# EAGLE board capewings (EAGLE 6.3), part 1 of 2
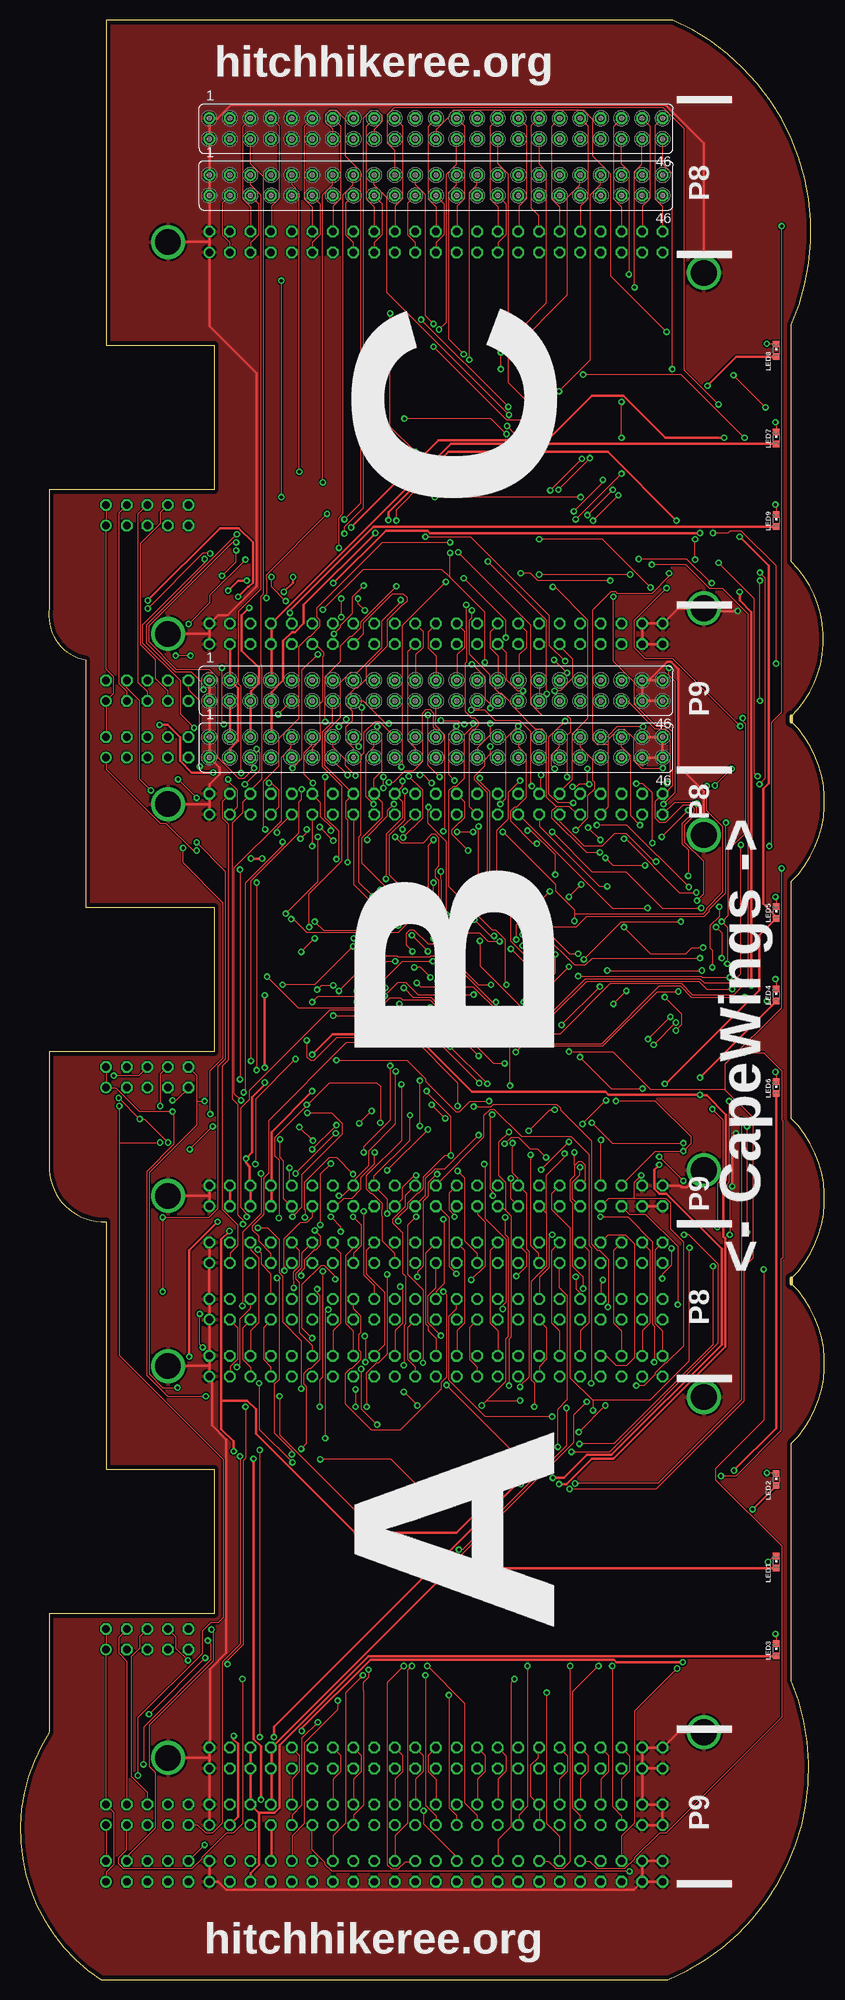
[diagram p3: board, top side]
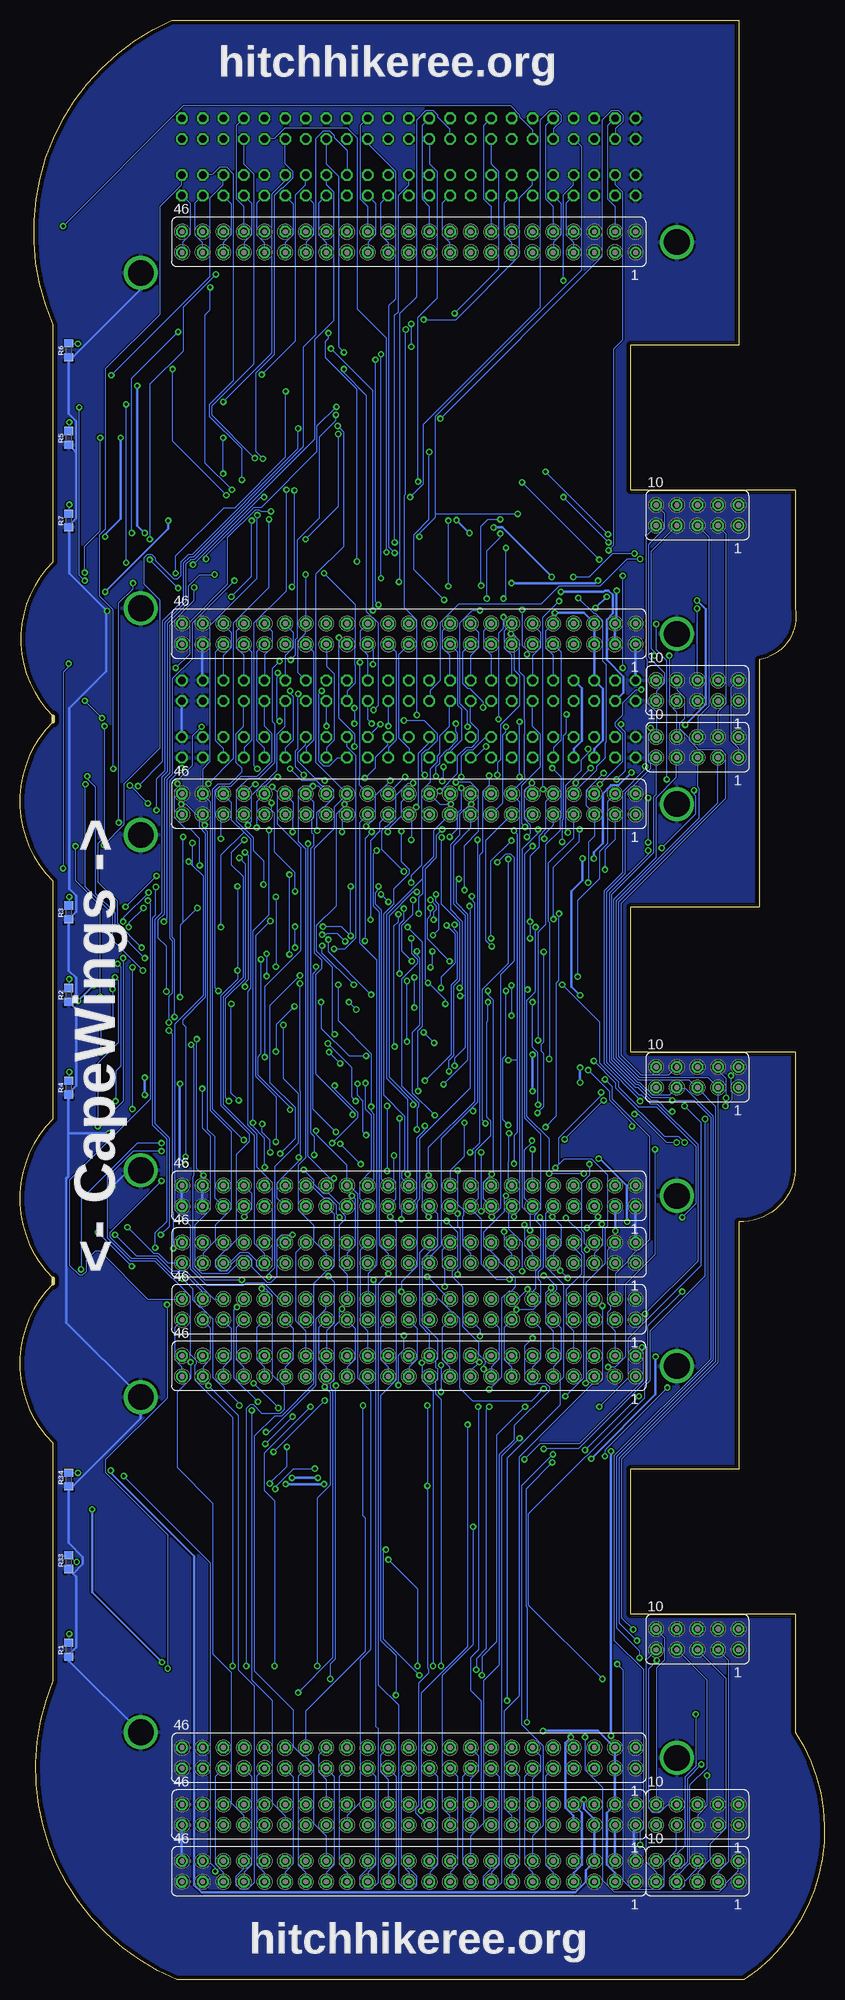
[diagram p4: board, bottom side, seen from below]

Size 99.1 x 241.3 mm. Coordinates in mm from the lower left corner, seen from the top.
Outline: 3.59,183.51 3.59,168.91 arc90 8.04,162.56 8.04,132.08 23.91,132.08 23.91,114.3 3.59,114.3 3.59,99.69 arc90 10.58,93.34 10.58,62.86 23.91,62.86 23.91,45.09 3.59,45.09 3.59,30.48 arc90 9.94,0 79.79,0 arc90 95.03,36.83 95.03,66.04 arc90 95.03,85.72 95.03,86.36 arc90 95.03,106.05 95.03,135.25 arc90 95.03,154.94 95.03,155.57 arc90 95.03,174.62 95.03,203.83 arc90 80.43,241.3 10.58,241.3 10.58,201.3 23.91,201.3 23.91,183.51 3.59,183.51
Copper layers (1*16): Top 0.035mm / dielectric 1.5mm / Bottom 0.035mm
Design rules "default": minimum track width 6mil, minimum drill 15mil, track to track 6mil, track to pad 6mil, pad to pad 6mil, via to via 6mil, smd to smd 6mil, copper to edge 20mil, drill to drill 8mil, minimum pad ring 10mil, minimum via ring 8mil, stop-mask expansion 4mil, vias tented up to drill 20mil, thermal gap 10mil
Net classes: 0 default: width 0.152 mm, drill 0.381 mm, clearance 0.152 mm; 1 pwr: width 0.305 mm, drill 0.381 mm, clearance 0.152 mm

## Footprints (pad centres in the part's own frame; a part is rotated, then mirrored left to right if it is on the bottom)
HOLE = drill 3.175: GND 0,0
CHIPLED_0603 = smd 0.8 x 0.8: A 0,-0.75; C 0,0.75
FE05-2 = drill 0.914: 1 -5.08,1.27 | drill 0.914 octagon: 2 -5.08,-1.27; 3 -2.54,1.27; 4 -2.54,-1.27; 5 0,1.27; 6 0,-1.27; 7 2.54,1.27; 8 2.54,-1.27; 9 5.08,1.27; 10 5.08,-1.27
FE23-2 = drill 0.914: 1 -24.13,1.27 | drill 0.914 octagon: 2 -24.13,-1.27; 3 -21.59,1.27; 4 -21.59,-1.27; 5 -19.05,1.27; 6 -19.05,-1.27; 7 -16.51,1.27; 8 -16.51,-1.27; 9 -13.97,1.27; 10 -13.97,-1.27; 11 -11.43,1.27; 12 -11.43,-1.27; 13 -8.89,1.27; 14 -8.89,-1.27; 15 -6.35,1.27; 16 -6.35,-1.27; 17 -3.81,1.27; 18 -3.81,-1.27; 19 -1.27,1.27; 20 -1.27,-1.27; 21 1.27,1.27; 22 1.27,-1.27; 23 3.81,1.27; 24 3.81,-1.27; 25 6.35,1.27; 26 6.35,-1.27; 27 8.89,1.27; 28 8.89,-1.27; 29 11.43,1.27; 30 11.43,-1.27; 31 13.97,1.27; 32 13.97,-1.27; 33 16.51,1.27; 34 16.51,-1.27; 35 19.05,1.27; 36 19.05,-1.27; 37 21.59,1.27; 38 21.59,-1.27; 39 24.13,1.27; 40 24.13,-1.27; 41 26.67,1.27; 42 26.67,-1.27; 43 29.21,1.27; 44 29.21,-1.27; 45 31.75,1.27; 46 31.75,-1.27
R0603 = smd 1 x 1.1: 1 -0.85,0; 2 0.85,0

## Placement (x,y rotation side)
H1  [HOLE]  18.2,96.52 0 top
H2  [HOLE]  84.24,99.69 0 top
H3  [HOLE]  18.2,144.78 0 top
H4  [HOLE]  84.24,140.97 0 top
H5  [HOLE]  18.2,165.74 0 top
H6  [HOLE]  84.24,168.91 0 top
H7  [HOLE]  84.24,210.19 0 top
H8  [HOLE]  18.2,214 0 top
H9  [HOLE]  18.2,27.3 0 top
H10  [HOLE]  84.24,30.48 0 top
H11  [HOLE]  18.2,75.56 0 top
H12  [HOLE]  84.24,71.75 0 top
LED1  [CHIPLED_0603]  93.13,51.44 0 top
LED2  [CHIPLED_0603]  93.13,61.59 0 top
LED3  [CHIPLED_0603]  93.13,40.64 0 top
LED4  [CHIPLED_0603]  93.13,121.28 0 top
LED5  [CHIPLED_0603]  93.13,131.44 0 top
LED6  [CHIPLED_0603]  93.13,109.86 0 top
LED7  [CHIPLED_0603]  93.13,189.87 0 top
LED8  [CHIPLED_0603]  93.13,200.66 0 top
LED9  [CHIPLED_0603]  93.13,179.7 0 top
P1  [FE05-2]  15.66,180.34 180 bottom
P2  [FE23-2]  47.41,165.74 180 bottom
P3  [FE23-2]  47.41,214 180 bottom
P4  [FE05-2]  15.66,41.91 180 bottom
P5  [FE23-2]  47.41,27.3 180 bottom
P6  [FE05-2]  15.66,111.12 180 bottom
P7  [FE23-2]  47.41,75.56 180 bottom
P8  [FE23-2]  47.41,144.78 180 bottom
P9  [FE23-2]  47.41,96.52 180 bottom
P10  [FE05-2]  15.66,151.76 180 bottom
P11  [FE23-2]  47.41,151.76 0 top
P12  [FE23-2]  47.41,220.98 0 top
P13  [FE05-2]  15.66,158.75 180 bottom
P14  [FE23-2]  47.41,158.75 0 top
P15  [FE23-2]  47.41,227.97 0 top
P16  [FE05-2]  15.66,20.32 180 bottom
P17  [FE23-2]  47.41,20.32 180 bottom
P18  [FE23-2]  47.41,89.53 180 bottom
P19  [FE05-2]  15.66,13.33 180 bottom
P20  [FE23-2]  47.41,13.33 180 bottom
P21  [FE23-2]  47.41,82.55 180 bottom
R1  60  [R0603]  93.13,40.64 90 bottom
R2  4.75K  [R0603]  93.13,121.28 90 bottom
R3  4.75K  [R0603]  93.13,131.44 90 bottom
R4  60  [R0603]  93.13,109.86 90 bottom
R5  4.75K  [R0603]  93.13,189.87 90 bottom
R6  4.75K  [R0603]  93.13,200.66 90 bottom
R7  60  [R0603]  93.13,179.7 90 bottom
R33  4.75K  [R0603]  93.13,51.44 90 bottom
R34  4.75K  [R0603]  93.13,61.59 90 bottom

## Tracks (layer width: path | path; a pad name or v marks a point on that pad's centre or on a via)
1-1.8V  (via drill 0.38)
  Top 0.152: v62.5,38.63 62.5,21.34 61.43,20.27 61.43,19.05 P17.31 | v61.58,73 61.58,73.15 62.65,74.22 62.65,89.69 62.34,89.99 62.34,96.85 61.43,97.77 P9.32 61.35,97.84 61.35,98.68 60.67,99.36 v60.67,103.02 | v61.35,154.38 59.83,152.86 59.83,145.47 v59.14,144.78 | v60.36,110.11 v60.36,116.43
  Bottom 0.152: v62.5,38.63 62.5,59.28 60.9,60.88 60.9,72.31 v61.58,73 | v61.35,154.38 61.35,157.43 P14.32 | v59.14,144.78 59.14,144.55 60.13,143.56 60.13,132.28 62.57,129.84 62.57,126.64 60.59,124.66 60.59,116.66 v60.36,116.43 | v60.36,110.11 60.36,109.65 57.47,106.76 57.47,106.22 v60.67,103.02
1-+3V3  (via drill 0.38)
  Top 0.305: P9.3 25.84,95.25 25.84,97.77 P9.4 | v25.77,92.2 24.78,91.21 24.78,71.32 | 24.78,71.32 24.78,67.82 26.3,66.29 v26.3,65.08 | v26.3,30.02 26.3,29.57 26.83,29.03 26.83,20.04 25.84,19.05 P17.3 | v88.63,177.7 92.21,174.12 92.21,147.37 91.53,146.69 91.53,132.51 93.13,130.91 LED5.A 93.05,130.61 91.07,128.63 91.07,121.84 79.56,110.34 v79.41,110.34 | v86.73,189.89 79.49,189.89 74.31,195.07 70.42,195.07 64.93,189.59 51.52,189.59 v40.78,178.84 | v33.62,172.75 33.62,172.06 v32.47,170.92 | P11.3 25.84,153.09 25.84,157.43 P14.4 | 24.78,71.32 27.98,71.32 29.04,70.26 29.04,67.21 41.24,55.02 53.73,55.02 60.51,61.8 v62.42,61.8 | v65.62,61.8 66.99,61.8 69.81,64.62 72.86,64.62 86.42,78.18 86.42,89.99 79.64,96.77 78.73,96.77 78.12,97.38 78.12,99.75 v78.73,100.36
  Bottom 0.305: P20.4 25.84,14.63 25.84,19.05 P17.3 | v25.77,92.2 25.77,95.25 P9.3 | v26.3,30.02 v26.3,65.08 | v88.63,177.7 88.63,178 86.73,179.91 v86.73,189.89 | v40.78,178.84 39.71,178.84 v33.62,172.75 | v32.47,170.92 27.22,170.92 27.06,171.07 26.61,171.07 26.07,170.54 26.07,168.25 26.83,167.49 26.83,162.53 24.78,160.48 24.78,158.5 25.77,157.5 P14.4 | v65.62,61.8 v62.42,61.8 | v78.73,100.36 79.49,101.12 79.49,110.26 v79.41,110.34
1-+5V  (via drill 0.38)
  Top 0.305: P11.7 30.95,153.09 30.95,157.43 P14.8 30.95,157.58 30.95,158.57 32.4,160.02 32.4,164.9 33.46,165.96 33.84,165.96 34.91,167.03 34.91,169.32 v43.75,178.16 | P20.8 30.95,14.63 30.95,19.05 P17.7 | v83.76,111.1 92.6,119.94 | 92.6,119.94 93.13,120.47 LED4.A | v35.98,113.92 38.49,116.43 48.55,116.43 55.64,109.35 72.1,109.35 72.48,108.97 v83.76,108.97 83.83,108.89 84.59,108.89 86.96,106.53 86.96,98.45 86.65,98.15 86.65,91.52 86.88,91.29 86.88,77.95 73.09,64.16 70.42,64.16 67.3,61.04 v66.38,61.04 | v35.98,109.42 30.95,104.39 30.95,97.84 P9.8 30.95,97.69 30.95,95.25 P9.7 | v31.25,29.87 31.25,31.17 61.12,61.04 v61.66,61.04 | v45.35,179.76 45.35,180.75 52.74,188.14 72.4,188.14 v80.86,179.68 | v88.63,170.92 88.63,169.85 90.08,168.4 v90.08,122.45 | 92.6,119.94 v91.99,120.55
  Bottom 0.305: v83.76,108.97 v83.76,111.1 | v35.98,109.42 v35.98,113.92 | v31.25,29.87 31.94,29.19 31.94,21.18 30.95,20.19 30.95,19.05 P17.7 | v66.38,61.04 v61.66,61.04 | v45.35,179.76 v43.75,178.16 | v80.86,179.68 80.86,178.69 v88.63,170.92 | v91.99,120.55 v90.08,122.45
1-AIN0  (via drill 0.38)
  Top 0.152: v75.91,73.15 76.82,73.15 78.19,74.52 78.19,74.68 79.41,75.89 79.56,75.89 81.7,78.03 81.7,90.91 80.1,92.51 80.1,95.71 79.56,96.24 75.68,96.24 | 75.68,96.24 72.55,96.24 71.56,95.25 P9.39 | v76.75,154.31 73.55,154.31 72.33,153.09 71.56,153.09 P11.39 | v77.36,115.82 v80.1,118.57 | v76.52,99.06 75.68,98.22 75.68,96.24
  Bottom 0.152: v75.91,73.15 72.25,69.49 72.25,38.18 70.27,36.2 70.27,11.96 71.11,11.12 71.94,11.12 72.48,11.66 72.48,12.72 71.56,13.64 71.56,14.55 P20.40 | v76.75,154.31 77.89,153.16 77.89,149.58 79.49,147.98 79.95,147.98 80.4,147.52 80.4,128.4 80.1,128.09 v80.1,118.57 | v77.36,115.82 77.36,99.9 v76.52,99.06
1-AIN1  (via drill 0.38)
  Top 0.152: v78.12,76.05 78.12,80.47 77.89,80.7 77.89,90.91 74.84,93.95 v71.49,93.95 | v71.56,103.4 71.56,97.84 P9.40
  Bottom 0.152: v78.12,76.05 78.12,73.99 79.79,72.31 79.79,63.09 75.37,58.67 75.37,40.16 73.09,37.87 73.09,21.79 71.56,20.27 71.56,19.05 P17.39 | v71.49,93.95 70.57,94.87 70.57,96.85 71.49,97.77 P9.40 | v71.56,103.4 75.37,107.21 75.37,146.61 74.69,147.3 73.24,147.3 71.79,148.74 71.79,149.2 72.48,149.88 72.48,153.47 71.56,154.38 71.56,157.43 P14.40
1-AIN2  (via drill 0.38)
  Top 0.152: v91.6,87.48 91.6,68.88 85.66,62.94 85.66,61.57 93.81,53.42 93.81,32.31 79.56,18.06 78.73,18.06 75.68,15.01 75.68,14.86 74.46,13.64 71.11,13.64 70.19,14.55 69.05,14.55 P20.38 | v81.7,103.02 72.94,103.02 v70.42,105.54 | v68.97,100.05 68.97,99.14 68.06,98.22 68.06,96.16 68.97,95.25 P9.37 | v68.44,141.58 69.96,143.1 69.96,145.85 70.8,146.69 70.8,147.45 70.57,147.68 70.57,150.27 69.05,151.79 69.05,153.01 P11.37
  Bottom 0.152: v91.6,87.48 91.6,96.09 84.67,103.02 v81.7,103.02 | v68.97,100.05 68.97,103.63 70.42,105.08 v70.42,105.54 70.42,129.16 68.44,131.14 v68.44,141.58
1-AIN3  (via drill 0.38)
  Top 0.152: v71.26,38.63 68.06,35.43 68.06,21.18 68.97,20.27 68.97,19.05 P17.37 | v69.35,85.11 69.35,86.56 68.06,87.86 68.06,95.71 67.75,96.01 67.75,98.45 68.29,98.98 68.29,100.28 68.33,100.32 | 68.33,100.32 68.74,100.74 69.2,100.74 69.66,100.28 69.66,98.45 P9.38 | v73.09,120.17 v74.69,121.77 | v69.28,105.38 v72.17,108.28 | v68.29,101.88 68.29,100.36 68.33,100.32
  Bottom 0.152: v71.26,38.63 71.26,70.33 70.8,70.79 70.34,70.79 69.28,69.72 67.07,69.72 66.61,70.18 66.61,73.08 68.06,74.52 68.06,84.28 68.9,85.11 v69.35,85.11 | v74.69,121.77 75.07,122.15 75.07,146.46 74.54,146.99 73.09,146.99 71.87,148.21 69.89,148.21 68.06,150.04 68.06,153.47 68.97,154.38 68.97,157.43 P14.38 | v73.09,120.17 73.09,109.19 v72.17,108.28 | v69.28,105.38 69.28,104.39 68.29,103.4 v68.29,101.88
1-AIN4  (via drill 0.38)
  Top 0.152: v67.75,38.63 67.75,14.55 66.84,13.64 66.08,13.64 65.16,14.55 63.94,14.55 P20.34 | v63.33,70.56 63.33,73.53 62.95,73.91 62.95,85.95 64.86,87.86 64.86,94.34 64.82,94.37 | 64.82,94.37 63.94,95.25 P9.33 | v61.58,147.68 60.13,146.23 60.13,142.95 58.76,141.58 58.76,135.64 60.44,133.96 60.44,127.86 v64.63,123.67 | v67.07,101.73 67.07,101.27 64.86,99.06 64.86,94.41 64.82,94.37
  Bottom 0.152: v67.75,38.63 67.75,58.98 69.05,60.27 69.05,64.85 v63.33,70.56 | v61.58,147.68 61.89,147.98 62.8,147.98 64.86,150.04 64.86,151.18 63.94,152.09 63.94,153.01 P11.33 | v64.63,123.67 68.29,120.02 68.29,110.49 65.16,107.37 65.16,103.63 v67.07,101.73
1-AIN5  (via drill 0.38)
  Top 0.152: v70.57,70.1 70.57,71.32 70.54,71.36 | 70.54,71.36 67.75,74.14 67.75,92.58 65.47,94.87 65.47,96.77 66.46,97.77 P9.36 | v71.03,142.19 74.76,142.19 v82.38,134.57 | v82.46,90.14 82.46,76.2 77.66,71.4 70.57,71.4 70.54,71.36
  Bottom 0.152: P17.35 66.46,20.19 68.06,21.79 68.06,34.44 70.57,36.96 v70.57,70.1 | P14.36 66.46,154.38 67.45,153.39 67.45,148.97 70.57,145.85 70.57,142.65 v71.03,142.19 | v82.38,134.57 82.38,131.14 82.77,130.76 82.77,105.23 81.01,103.48 81.01,93.42 82.46,91.97 v82.46,90.14
1-AIN6  (via drill 0.38)
  Top 0.152: P20.36 66.46,17.68 64.86,19.28 v64.86,35.36 | v59.45,82.6 59.45,83.06 59.83,83.44 59.83,91.21 57.24,93.8 57.24,100.36 v57.16,100.43 | v59.68,102.95 60.44,103.71 61.43,103.71 62.88,102.26 63.79,102.26 v64.78,101.27 | P11.35 66.46,151.87 65.47,150.88 65.47,149.5 v65.85,149.12 | v62.5,141.5 62.95,141.5 65.93,138.53 v65.93,136.09 | v65.93,126.26 65.93,123.98 v64.63,122.68
  Bottom 0.152: v64.86,35.36 60.59,39.62 60.59,72.62 60.9,72.92 60.9,73.38 60.44,73.84 60.44,80.39 59.83,81 59.83,82.22 v59.45,82.6 | v59.68,102.95 v57.16,100.43 | P9.35 67.45,96.24 67.45,98.15 64.78,100.81 v64.78,101.27 64.55,101.5 64.55,109.35 64.63,109.42 v64.63,122.68 | v65.85,149.12 64.4,147.68 62.57,147.68 61.89,146.99 60.97,146.99 60.44,146.46 60.44,145.62 61.58,144.47 61.81,144.47 62.5,143.79 v62.5,141.5 | v65.93,126.26 v65.93,136.09
1-BAT  (via drill 0.38)
  Top 0.152: P19.2 10.6,14.63 10.6,19.05 P16.1 | P6.2 10.6,112.39 10.6,109.88 P6.1 10.6,109.8 11.82,109.8 14.72,106.91 v18.76,106.91 18.91,106.76 18.91,102.87 15.56,99.52 15.56,74.45 18.15,71.86 v22.87,71.86 | v21.73,139.06 21.27,139.06 17.92,142.42 17.23,142.42 10.6,149.05 10.6,150.5 P10.1 | v29.5,65.23 v29.5,29.87
  Bottom 0.152: P10.1 10.6,150.5 10.6,151.71 11.52,152.63 11.52,159.11 10.6,160.02 P13.2 | v18.76,106.91 19.21,106.91 20.59,108.28 21.42,108.28 23.02,109.88 23.33,109.88 26.53,113.08 26.53,133.81 21.73,138.61 v21.73,139.06 | v29.5,29.87 29.5,25.83 27.37,23.7 27.37,12.27 25.92,10.82 12.97,10.82 12.13,11.66 12.13,11.89 10.6,13.41 10.6,14.55 P19.2 | v22.87,71.86 v29.5,65.23
1-BAT_SENSE  (via drill 0.38)
  Top 0.152: P19.4 13.12,15.16 16.62,18.67 16.62,25.53 15.86,26.29 15.86,31.32 23.79,39.24 23.79,42.9 v23.56,43.13
  Bottom 0.152: v23.56,43.13 25.01,44.58 25.01,64.08 13.12,75.97 P6.3 13.12,109.88 14.34,111.1 22.72,111.1 25.31,113.69 25.31,132.74 13.12,144.93 P10.3
1-BAT_TEMP  (via drill 0.38)
  Top 0.152: P16.3 13.12,16 12.13,15.01 12.13,14.25 12.74,13.64 21.12,13.64 22.34,14.86 22.34,15.01 25.39,18.06 26.22,18.06 27.37,19.2 v27.37,37.03 | v12.13,108.58 v14.72,105.99 15.33,105.99 v18.22,103.1 | P13.4 13.12,159.11 14.72,157.5 14.72,147.83 v16.09,146.46 | v20.05,139.37 20.05,137.54 25.01,132.59 25.01,113.54 23.41,111.94 v23.41,106.6
  Bottom 0.152: v27.37,37.03 36.51,46.18 36.51,57.3 22.19,71.63 22.19,73.08 21.5,73.76 21.5,79.86 14.72,86.64 v14.72,105.99 | v12.13,108.58 12.13,111.02 13.12,112.01 P6.4 | v16.09,146.46 16.09,146 15.86,145.77 15.86,143.56 v20.05,139.37 | v23.41,106.6 22.95,106.6 19.44,103.1 v18.22,103.1
1-BL_IN  (via drill 0.38)
  Top 0.152: v25.54,38.86 25.54,39.32 27.44,41.22 27.44,63.93 27.75,64.24 v27.75,70.56 | v17.23,107.59 17.23,111.48 18.15,112.39 P6.8
  Bottom 0.152: v25.54,38.86 24.85,38.18 24.85,12.27 23.71,11.12 20.28,11.12 19.75,11.66 19.75,14.4 18.22,15.93 18.22,19.05 P16.7 | v27.75,70.56 24.24,74.07 24.24,78.94 15.25,87.94 15.25,105.61 v17.23,107.59 | P13.8 18.15,160.02 18.15,158.8 17.23,157.89 17.23,155.37 17.84,154.76 17.84,154.08 16.62,152.86 16.62,152.63 15.48,151.49 12.74,151.49 12.13,150.88 12.13,145.47 25.01,132.59 25.01,113.84 22.57,111.4 19.21,111.4 18.22,112.39 P6.8
1-BL_ISET1  (via drill 0.38)
  Top 0.152: v14.49,25.15 14.49,32.23 22.41,40.16 22.41,42.9 23.48,43.97 24.4,43.97 25.01,44.58 25.01,64.08 12.2,76.89 12.2,103.1 | v12.2,107.59 12.2,103.1 | v11.52,111.33 14.57,111.33 15.63,112.39 P6.6 | v15.71,168.86 22.49,175.64 v23.41,175.64 | v30.95,172.75 30.95,171.53 v32.7,169.77 | v34.68,146.61 34.68,145.39 34.38,145.09 34.38,141.28 28.43,135.33 v28.43,113.16 | 12.2,103.1 v17.23,103.1
  Bottom 0.152: v14.49,25.15 14.49,21.41 15.63,20.27 15.63,19.05 P16.5 | v12.2,107.59 11.44,108.36 11.44,109.35 11.52,109.42 v11.52,111.33 | v15.71,168.86 15.71,160.02 P13.6 | v23.41,175.64 26.07,175.64 28.97,172.75 v30.95,172.75 | v32.7,169.77 34.68,167.79 v34.68,146.61 | v28.43,113.16 25.69,110.41 25.69,109.8 19.67,103.78 17.92,103.78 v17.23,103.1
1-BL_ISET2  (via drill 0.38)
  Top 0.152: v15.18,26.52 15.18,31.09 23.48,39.39 23.48,41.38 v23.1,41.76
  Bottom 0.152: v15.18,26.52 16.93,24.77 16.93,14.48 17.77,13.64 18,13.64 19.14,12.5 19.14,11.66 18.6,11.12 17.77,11.12 17.23,11.66 17.23,12.12 15.71,13.64 15.71,14.55 P19.6 | v23.1,41.76 25.31,43.97 25.31,64.24 13.42,76.12 13.42,107.59 15.63,109.8 P6.5 15.71,109.88 16.62,110.8 22.87,110.8 25.62,113.54 25.62,132.89 15.4,143.1 15.4,146.69 15.63,146.91 15.63,150.5 P10.5
1-BL_OUT  (via drill 0.38)
  Top 0.152: v22.8,39.62 v15.86,32.69
  Bottom 0.152: v15.86,32.69 15.86,26.29 17.23,24.92 17.23,16.46 18.15,15.55 18.15,14.63 P19.8 | v22.8,39.62 22.8,40.54 25.62,43.36 25.62,64.39 13.73,76.28 13.73,106.38 17.16,109.8 18.15,109.8 P6.7 18.22,109.8 19.14,108.89 21.12,108.89 22.72,110.49 23.02,110.49 25.92,113.39 25.92,133.05 20.74,138.23 20.74,145.54 18.22,148.06 18.22,150.5 P10.7
1-BL_SINK1  (via drill 0.38)
  Top 0.152: v22.72,16.61 20.74,14.63 P19.10 | v18.76,108.28 19.21,108.28 20.74,109.8 P6.9
  Bottom 0.152: v22.72,16.61 22.72,18.21 22.34,18.59 22.34,38.25 25.92,41.83 25.92,64.54 14.03,76.43 14.03,106.22 16.09,108.28 v18.76,108.28 19.06,108.58 21.27,108.58 22.87,110.19 23.18,110.19 26.22,113.23 26.22,133.66 21.04,138.84 21.04,145.69 20.74,146 P10.9
1-BL_SINK2  (via drill 0.38)
  Top 0.152: P16.9 21.88,19.05 22.87,18.06 23.63,18.06 24.85,19.28 24.85,39.09 27.06,41.3 v27.06,64.47 | v19.37,72.92 17.54,72.92 15.86,74.6 15.86,99.36 21.73,105.23 21.73,108.2 | 21.73,108.2 21.73,111.4 P6.10 | P13.10 20.74,158.88 22.11,157.5 v22.11,149.43 | 21.73,108.2 v22.72,108.2
  Bottom 0.152: v27.06,64.47 27.06,65.23 v19.37,72.92 | v22.11,149.43 22.11,149.05 24.85,146.3 24.85,136.4 27.14,134.11 27.14,112.78 22.72,108.36 v22.72,108.2
1-CLKOUT2  (via drill 0.38)
  Top 0.152: P20.42 74.08,17.68 75.68,19.28 75.68,33.07 v80.94,38.33 | v81.01,83.13 81.01,90.3 77.05,94.26 75.07,94.26 P9.41 | P11.41 74.08,151.87 75.22,150.72 75.22,143.33 v76.36,142.19
  Bottom 0.152: v80.94,38.33 80.94,54.79 88.63,62.48 88.63,64.01 81.01,71.63 v81.01,83.13 | v76.36,142.19 76.36,141.73 75.98,141.35 75.98,104.7 75.07,103.78 75.07,96.24 P9.41
1-EHRPWM1A  (via drill 0.38)
  Top 0.152: v27.37,82.98 27.37,92.05 29.65,94.34 v29.65,99.29 | v38.87,104.24 v33.92,99.29 | v35.6,129.62 35.6,133.73 39.64,137.77 39.64,146.99 37.27,149.35 37.27,153.69 38.49,154.91 38.49,157.43 P14.14
  Bottom 0.152: v27.37,82.98 27.37,73.91 27.98,73.3 28.66,73.3 37.65,64.31 37.65,34.9 39.48,33.07 39.48,21.18 38.57,20.27 38.57,19.05 P17.13 | v29.65,99.29 v33.92,99.29 33.92,103.56 36.66,106.3 36.66,120.62 35.6,121.69 v35.6,129.62 | v38.87,104.24 38.87,100.81 38.95,100.74 38.95,98.22 P9.14
1-EHRPWM1B  (via drill 0.38)
  Top 0.152: v42.91,38.18 42.91,37.26 42.23,36.58 42.23,35.66 42.3,35.59 42.3,21.49 41.08,20.27 41.08,19.05 P17.15 | v41.31,72.69 v41.31,70.56 | v39.26,96.55 39.71,96.55 41.01,97.84 P9.16 41.08,97.84 41.08,98.37 42.99,100.28 42.99,102.11 46.27,105.38 v46.27,111.86 | v45.43,154.69 45.05,154.69 42.3,157.43 41.08,157.43 P14.16 | v47.87,148.21 49.62,146.46 49.62,143.1 v47.18,140.66
  Bottom 0.152: v42.91,38.18 42.91,39.55 41.69,40.77 41.69,70.18 v41.31,70.56 | v41.31,72.69 39.79,74.22 39.79,83.9 38.87,84.81 38.57,84.81 38.11,85.27 38.11,86.49 40.09,88.47 40.09,88.7 41.24,89.84 41.46,89.84 42,90.37 42,92.05 39.48,94.56 39.48,96.32 v39.26,96.55 | v45.43,154.69 45.43,153.69 45.2,153.47 45.2,152.63 46.34,151.49 46.49,151.49 47.41,150.57 47.41,149.81 47.87,149.35 v47.87,148.21 | v47.18,140.66 47.18,132.44 44.89,130.15 44.89,123.14 45.66,122.38 45.66,113.84 46.27,113.23 v46.27,111.86
1-EHRPWM2A  (via drill 0.38)
  Top 0.152: v48.93,86.56 48.93,87.17 49.62,87.86 49.62,95.86 50.23,96.47 50.23,98.15 51.29,99.21 v51.37,99.21 | v86.04,194 81.85,198.2 81.85,227.91 79.26,230.5 46.04,230.5 45.2,229.67 45.2,226.24 46.11,225.32 46.11,222.28 P12.19 | v86.04,174.5 90.46,170.08 90.46,148.59 v90.84,148.21 | v83.76,125.81 70.5,125.81 69.66,124.97 68.29,124.97 64.55,128.7 v61.89,128.7 | v59.07,127.86 57.62,127.86 56.55,128.93 51.14,128.93 50,130.07 v50,131.29
  Bottom 0.152: v48.93,86.56 46.19,83.82 P21.20 | v51.37,99.21 51.37,108.43 53.96,111.02 53.96,131.14 49.58,135.52 | 49.58,135.52 49.54,135.56 49.54,136.93 48.17,138.3 48.17,141.5 46.19,143.49 P8.19 | v86.04,174.5 v86.04,194 | v90.84,148.21 90.84,147.9 89.78,146.84 89.78,133.73 87.41,131.37 87.41,129.46 v83.76,125.81 | v61.89,128.7 61.43,128.7 61.35,128.78 59.98,128.78 v59.07,127.86 | v50,131.29 50,133.27 49.54,133.73 49.54,135.48 49.58,135.52
1-EHRPWM2B  (via drill 0.38)
  Top 0.152: v36.59,85.04 36.59,84.58 36.97,84.2 36.97,76.43 35.83,75.29 35.6,75.29 34.99,74.68 34.99,73.3 35.29,73 35.29,66.06 v34.61,65.38 | v17.54,84.73 v17.54,93.88 23.25,93.88 24.4,95.02 24.4,112.47 25.31,113.39 25.31,136.47 v21.73,140.06 | v32.32,122.53 36.28,122.53 v41.01,127.25 | v37.27,184.4 37.27,219.84 38.49,221.06 38.49,222.2 P12.13 | v27.75,174.88 23.41,170.54 23.41,169.62 v20.74,166.95 | v21.73,145.54 v19.44,147.83
  Bottom 0.152: P21.14 37.81,83.82 v36.59,85.04 | v34.61,65.38 30.34,65.38 21.81,73.91 21.81,80.47 v17.54,84.73 | v17.54,93.88 15.86,95.55 15.86,102.64 20.74,107.52 22.95,107.52 25.39,109.96 25.39,110.57 27.75,112.93 27.75,117.96 v32.32,122.53 | v41.01,127.25 41.77,128.02 41.77,140.28 38.57,143.49 P8.13 | v27.75,174.88 v37.27,184.4 | v20.74,166.95 20.74,163.75 19.44,162.46 v19.44,147.83 | v21.73,140.06 v21.73,145.54
1-GPIO0_7  (via drill 0.38)
  Top 0.152: P17.41 74.08,20.19 72.94,21.34 v72.94,38.63 | P9.42 74.08,97.84 78.27,102.03 v81.7,102.03 82.69,103.02 82.69,103.78 78.27,108.2 v73.39,108.2 | v79.72,147.3 80.1,147.68 80.1,153.47 79.56,154 78.27,154 74.84,157.43 74.08,157.43 P14.42 | v76.97,137.24 73.01,137.24 v72.1,138.15
  Bottom 0.152: v72.94,38.63 72.94,69.27 77.58,73.91 77.58,75.67 77.43,75.82 77.43,76.28 78.19,77.04 78.19,84.2 82.54,88.54 85.58,88.54 88.4,91.36 88.4,98.83 85.2,102.03 v81.7,102.03 | v79.72,147.3 79.72,146.84 80.1,146.46 80.1,143.1 78.65,141.66 78.12,141.66 76.97,140.51 v76.97,137.24 | v72.1,138.15 71.34,137.39 71.34,123.29 73.77,120.85 73.77,108.58 v73.39,108.2
1-GPIO0_26  (via drill 0.38)
  Top 0.152: v39.48,92.13 39.48,92.73 v38.26,93.95 | v39.94,179.83 42,181.89 42,222.66 40.09,224.56 40.09,229.06 38.95,230.2 38.11,230.2 37.58,229.67 37.58,228.83 38.49,227.91 38.49,226.69 P15.14 | v42.3,171.68 40.93,170.31 40.93,168.25 39.48,166.8 39.48,166.57 v38.65,165.74
  Bottom 0.152: v39.48,92.13 39.48,90.37 38.57,89.46 38.57,88.32 P18.13 | v38.26,93.95 38.26,94.11 37.58,94.79 37.58,145.09 38.49,146 P8.14 38.49,146.07 38.49,146.3 36.89,147.9 36.89,148.36 36.97,148.44 36.97,153.39 36.89,153.47 36.89,155.14 36.97,155.22 36.97,160.48 37.58,161.09 37.58,164.9 38.42,165.74 v38.65,165.74 | v39.94,179.83 41.46,179.83 42.3,178.99 v42.3,171.68
1-GPIO0_27  (via drill 0.38)
  Top 0.152: P21.18 43.6,85.5 42.3,86.79 v42.3,94.64 | v42.3,101.88 42.3,102.56 45.58,105.84 v45.58,112.55 | P12.17 43.6,221.06 45.2,219.46 45.2,207.72 v60.21,192.71 | v67.37,160.93 v65.77,162.53 | v67.14,154.99 66.15,154 66.08,154 65.16,153.09 65.16,146 66.23,144.93 v68.13,144.93 | v65.24,134.04 61.12,129.92 v61.12,128.09 | v55.87,121.31 49.01,121.31 47.48,122.83 46.57,122.83 v44.89,121.16
  Bottom 0.152: v42.3,101.88 v42.3,94.64 | v45.58,112.55 45.58,113.46 44.28,114.76 44.28,121.16 | 44.28,121.16 44.28,131.06 45.73,132.51 45.73,139.68 43.6,141.81 P8.17 | v60.21,192.71 60.21,192.02 62.19,190.04 62.19,180.06 64.93,177.32 64.93,165.28 65.16,165.05 65.16,163.14 v65.77,162.53 | v67.37,160.93 67.37,160.48 67.45,160.4 67.45,155.3 v67.14,154.99 | v68.13,144.93 68.13,144.02 67.75,143.64 67.75,138.84 65.24,136.32 v65.24,134.04 | v61.12,128.09 61.12,126.57 v55.87,121.31 | 44.28,121.16 v44.89,121.16
1-GPIO1_0  (via drill 0.38)
  Top 0.152: v65.54,69.34 57.31,69.34 52.82,73.84 52.82,81.69 53.73,82.6 53.73,83.82 P21.26 | v68.9,65.99 73.16,65.99 85.36,78.18 v85.36,87.86 | v89.55,105.08 v89.55,92.05 | v87.41,123.44 84.06,123.44 83.91,123.6 v68.74,123.6 | v68.74,126.34 67.68,126.34 64.32,129.69 v61.81,129.69 | v58.38,128.55 57.92,128.55 v55.94,130.53 | v54.65,200.18 52.82,202.01 52.82,220.14 53.73,221.06 53.73,222.2 P12.25 | v54.65,172.59 59.83,167.41 v59.83,165.28 | v57.92,151.87 57.92,150.95 57.24,150.27 57.24,149.5 55.94,148.21 55.94,147.75 57.54,146.15 57.54,135.48 v58.38,134.64
  Bottom 0.152: v68.9,65.99 v65.54,69.34 | v89.55,92.05 v85.36,87.86 | v89.55,105.08 89.55,112.85 87.03,115.37 87.03,123.06 v87.41,123.44 | v68.74,126.34 v68.74,123.6 | v61.81,129.69 59.52,129.69 v58.38,128.55 v58.38,134.64 | v55.94,130.53 55.94,140.28 54.8,141.43 54.8,142.49 53.81,143.49 P8.25 | v54.65,172.59 v54.65,200.18 | v59.83,165.28 59.83,155.37 57.85,153.39 57.85,151.94 v57.92,151.87
1-GPIO1_1  (via drill 0.38)
  Top 0.152: P18.23 51.22,85.19 50.23,84.2 50.23,80.92 v51.83,79.32 | v62.8,62.94 v52.51,73.23 | v67.68,60.43 78.35,60.43 89.17,71.25 89.17,87.78 90.23,88.85 90.23,106.22 86.84,109.61 | 86.84,109.61 86.8,109.65 77.66,109.65 73.01,114.3 v67.6,114.3 | v65.32,119.86 62.42,119.86 62.27,119.71 61.81,119.71 56.63,124.89 v56.63,127.94 | v53.81,141.35 v55.79,141.35 | P15.24 51.22,227.84 52.82,229.44 52.82,229.67 53.35,230.2 69.43,230.2 70.57,229.06 70.57,224.56 72.78,222.35 72.78,209.78 v79.64,202.92 | v85.36,178.16 87.18,178.16 87.41,178.38 88.86,178.38 93.13,174.12 v93.13,162.08 | v93.81,136.85 93.81,119.71 86.88,112.78 86.88,109.65 86.84,109.61
  Bottom 0.152: v51.83,79.32 51.83,77.57 52.51,76.89 v52.51,73.23 | v62.8,62.94 65.39,62.94 67.68,60.66 v67.68,60.43 | v67.6,114.3 67.6,117.58 v65.32,119.86 | v56.63,127.94 56.63,140.51 v55.79,141.35 | v53.81,141.35 53.81,141.66 52.21,143.26 52.21,145.01 51.22,146 P8.24 | v79.64,202.92 85.36,197.21 v85.36,178.16 | v93.13,162.08 93.13,161.7 93.74,161.09 93.74,136.93 v93.81,136.85
1-GPIO1_2  (via drill 0.38)
  Top 0.152: P21.6 28.36,82.68 27.06,81.38 27.06,75.82 v26.68,75.44 | v23.71,105.08 v20.89,102.26 | v29.12,135.1 v29.12,112.01 | P12.5 28.36,221.06 29.65,219.76 29.65,171.3 26.91,168.55 26.91,159.56 27.22,159.26 v27.22,148.59
  Bottom 0.152: v26.68,75.44 25.84,75.44 24.55,76.73 24.55,85.65 20.89,89.31 v20.89,102.26 | v23.71,105.08 23.71,105.54 26.53,108.36 26.53,109.42 v29.12,112.01 | v29.12,135.1 29.12,140.06 28.36,140.82 P8.5 28.36,143.56 29.35,144.55 29.35,146.46 v27.22,148.59
1-GPIO1_3  (via drill 0.38)
  Top 0.152: v27.44,93.04 27.44,93.5 26.76,94.18 26.76,107.82 26.07,108.51 26.07,142.42 27.37,143.71 27.37,145.01 28.36,146 P8.6 28.36,146.46 29.81,147.9 29.81,161.77 29.65,161.93 29.65,170.38 29.96,170.69 29.96,222.05 28.36,223.65 P15.6
  Bottom 0.152: P18.5 28.36,89.46 27.37,90.45 27.37,92.96 v27.44,93.04
1-GPIO1_4  (via drill 0.38)
  Top 0.152: P21.24 51.22,84.73 52.21,85.72 52.21,93.57 v52.13,93.65 | v50.69,107.75 v52.36,106.07 | 50.23,134.64 50.23,139.68 v50.91,140.36 | 50.23,134.64 v50.23,133.96 | v52.97,177.01 44.67,177.01 36.59,168.94 36.59,167.79 36.97,167.41 36.97,166.65 35.75,165.43 35.6,165.43 34.38,164.21 34.38,155.37 31.86,152.86 31.86,149.5 29.96,147.6 29.96,141.88 v30.19,141.66 | v33.39,130.61 33.69,130.61 35.37,128.93 46.57,128.93 v48.17,130.53 | 50.23,134.64 v48.55,132.97
  Bottom 0.152: v52.13,93.65 52.13,94.79 52.36,95.02 v52.36,106.07 | v50.69,107.75 50.69,108.2 53.66,111.18 53.66,130.99 50.69,133.96 v50.23,133.96 | v50.91,140.36 50.91,143.18 51.22,143.49 P8.23 | P12.23 51.22,221.06 52.51,219.76 52.51,205.44 52.97,204.98 v52.97,177.01 | v30.19,141.66 30.19,140.21 33.39,137.01 v33.39,130.61 | v48.17,130.53 48.17,131.44 47.87,131.75 47.87,132.28 v48.55,132.97
1-GPIO1_5  (via drill 0.38)
  Top 0.152: v42.76,140.36 42.76,140.82 45.2,143.26 45.2,143.94 v46.04,144.78 | v50.08,184.48 49.77,184.48 46.34,181.05 v46.34,179.68 | v46.34,171.6 42,167.26 42,166.57 40.86,165.43 40.63,165.43 39.48,164.29 39.48,162.38 37.58,160.48 v37.58,154.91 | v37.58,148.13 37.58,143.1 39.26,141.43 39.26,138.3 v38.95,138 | v43.29,106.98 v41.77,105.46
  Bottom 0.152: 43.56,107.25 42.76,108.05 v42.76,140.36 | 43.56,107.25 47.26,103.56 47.26,90.37 48.63,89 48.63,88.32 P18.21 | v46.04,144.78 47.41,144.78 P8.22 | v50.08,184.48 50.08,204.75 47.71,207.11 47.71,222.66 48.63,223.57 48.63,226.69 P15.22 | v46.34,171.6 v46.34,179.68 | v37.58,148.13 v37.58,154.91 | v38.95,138 38.95,125.2 42.15,122 42.15,105.84 v41.77,105.46 | 43.56,107.25 v43.29,106.98
1-GPIO1_6  (via drill 0.38)
  Top 0.152: v27.06,136.7 v27.06,110.87 | v26.61,176.02 26.61,174.65 v24.85,172.9 | v24.85,161.54 24.85,154.84 v25.08,154.61 | v25.62,147.83 25.62,147.6 26.76,146.46 26.76,144.47 25.84,143.56 P8.3
  Bottom 0.152: v27.06,110.87 26.22,110.03 26.22,108.51 21.58,103.86 21.58,91.14 22.87,89.84 23.1,89.84 24.24,88.7 24.24,88.47 25.77,86.94 25.77,83.82 P21.4 | v27.06,136.7 27.06,139.14 25.84,140.36 25.84,143.49 P8.3 | v26.61,176.02 25.92,176.71 25.92,200.86 24.85,201.93 24.85,220.14 25.77,221.06 25.77,222.2 P12.3 | v24.85,161.54 v24.85,172.9 | v25.08,154.61 25.08,154.15 24.55,153.62 24.55,148.89 v25.62,147.83
1-GPIO1_7  (via drill 0.38)
  Top 0.152: P8.4 24.85,145.09 24.85,143.1 25.62,142.34 25.62,113.23 24.85,112.47 24.85,94.87 26.76,92.96 26.76,90.37 25.84,89.46 25.84,88.32 P18.3 | v47.33,192.25 58,192.25 v59.91,190.35 | v63.94,177.39 71.72,177.39 v77.66,171.45 | v81.09,121.69 78.5,121.69 71.79,114.99 61.81,114.99 v61.05,114.22 | v59.68,112.85 58.31,112.85 50.46,120.7 47.1,120.7 46.88,120.93 45.58,120.93 44.36,119.71 34.23,119.71 v30.42,123.52
  Bottom 0.152: v47.33,192.25 27.37,212.22 27.37,229.06 26.22,230.2 25.39,230.2 24.85,229.67 24.85,228.83 25.77,227.91 25.77,226.69 P15.4 | v59.91,190.35 59.91,181.43 v63.94,177.39 | v77.66,171.45 77.66,169.85 80.63,166.88 80.63,148.67 81.32,147.98 81.32,131.29 82.08,130.53 82.08,128.25 81.09,127.25 v81.09,121.69 | v59.68,112.85 v61.05,114.22 | v30.42,123.52 30.42,132.89 27.75,135.56 27.75,138.91 26.76,139.9 26.76,145.09 25.84,146 P8.4
1-GPIO1_12  (via drill 0.38)
  Top 0.152: v36.97,92.96 36.97,99.21 v38.26,100.51 | v38.26,141.5 38.26,141.96 36.97,143.26 36.97,145.01 35.98,146 P8.12 | v93.81,215.95 93.81,156.06 92.6,154.84 92.6,139.9 v92.29,139.6 | v89.24,121.01 82.69,121.01 81.32,122.38 78.73,122.38 71.64,115.29 v61.2,115.29 | v57.77,108.2 55.41,108.2 54.11,106.91 53.66,106.91 49.92,110.64 49.92,110.95 47.64,113.23 v38.95,113.23
  Bottom 0.152: P18.11 35.98,89.46 36.97,90.45 v36.97,92.96 | v38.26,100.51 38.26,103.94 37.88,104.32 37.88,113.23 | 37.88,113.23 37.88,141.12 v38.26,141.5 | P15.12 35.98,227.84 37.58,229.44 37.58,229.67 38.72,230.81 78.96,230.81 v93.81,215.95 | v92.29,139.6 92.29,135.33 89.24,132.28 v89.24,121.01 | v61.2,115.29 58.23,112.32 58.23,108.66 v57.77,108.2 | 37.88,113.23 v38.95,113.23
1-GPIO1_13  (via drill 0.38)
  Top 0.152: P8.11 v35.98,139.6 | v60.13,193.7 v49.39,204.44 | v76.21,174.95 82.16,174.95 85.13,171.98 v85.2,171.98 | v86.96,142.49 86.96,133.88 84.9,131.83 84.9,131.6 84.29,130.99 69.81,130.99 68.52,129.69 v65.24,129.69 | v65.24,127.1 62.12,127.1 v61.89,127.33 | v58,122.53 56.48,122.53 51.45,127.56 50.23,127.56 48.48,129.31 48.02,129.31 47.56,128.85 47.56,127.41 v48.32,126.64 | v48.55,124.66 49.31,124.66 v50.53,123.44 | v50.53,119.71 47.18,119.71 46.19,118.72 v38.57,118.72 | v38.57,122.45 37.12,122.45 v36.59,121.92
  Bottom 0.152: P21.12 35.98,84.73 35.6,85.11 35.6,87.25 34.99,87.86 34.99,92.89 35.75,93.65 35.75,94.11 34.99,94.87 34.99,104.16 36.97,106.15 36.97,121.92 | 36.97,121.92 36.97,138.61 v35.98,139.6 | P12.11 35.98,221.06 37.58,219.46 37.58,212.29 45.43,204.44 v49.39,204.44 | v60.13,193.7 62.5,191.34 62.5,188.21 69.35,181.36 70.27,181.36 76.21,175.41 v76.21,174.95 | v85.2,171.98 85.2,171.3 86.96,169.55 v86.96,142.49 | v65.24,127.1 v65.24,129.69 | v61.89,127.33 61.89,126.42 v58,122.53 | v48.32,126.64 48.32,124.89 v48.55,124.66 | v50.53,119.71 v50.53,123.44 | v38.57,122.45 v38.57,118.72 | 36.97,121.92 v36.59,121.92
1-GPIO1_14  (via drill 0.38)
  Top 0.152: v41.01,93.95 42,92.96 42,90.37 41.08,89.46 41.08,88.32 P18.15 | v40.32,137.62 40.32,142.88 40.09,143.1 40.09,145.09 P8.16 41.01,146.07 37.58,149.5 37.58,153.54 39.48,155.45 39.48,159.79 40.7,161.01 41.54,161.01 44.59,164.06 44.59,167.33 46.88,169.62 v46.88,169.93 | v45.58,205.21 45.58,191.26 v48.7,188.14
  Bottom 0.152: v41.01,93.95 39.94,95.02 39.94,123.75 38.26,125.42 38.26,138.23 38.72,138.68 39.26,138.68 v40.32,137.62 | v45.58,205.21 40.09,210.69 40.09,222.66 41.01,223.57 41.01,226.69 P15.16 | v48.7,188.14 48.7,179.83 50.61,177.93 50.61,173.66 v46.88,169.93
1-GPIO1_15  (via drill 0.38)
  Top 0.152: v52.13,84.73 52.51,84.35 52.51,74.22 51.83,73.53 51.83,72.69 46.8,67.67 43.29,67.67 40.09,70.87 40.09,74.68 40.7,75.29 40.86,75.29 42,76.43 42,77.27 41.77,77.5 41.77,79.48 42,79.7 42,81.69 41.08,82.6 41.08,83.82 P21.16 | v43.75,132.21 41.08,134.87 41.08,143.49 P8.15 | v39.26,176.33 39.26,180.06 39.79,180.59 39.79,219.84 41.01,221.06 41.01,222.2 P12.15 | v39.56,167.79 v39.56,170.08 | v39.26,154.31 v40.17,155.22
  Bottom 0.152: v52.13,84.73 52.13,85.95 50.23,87.86 50.23,95.78 49.92,96.09 49.92,103.56 43.67,109.8 43.67,132.13 v43.75,132.21 | v39.26,176.33 39.26,170.38 v39.56,170.08 | v39.56,167.79 39.56,166.42 40.09,165.89 40.09,155.3 v40.17,155.22 | v39.26,154.31 39.26,153.69 39.64,153.31 39.64,144.93 P8.15
1-GPIO1_16  (via drill 0.38)
  Top 0.152: v37.58,66.67 37.58,82.14 v37.96,82.53 | v35.06,93.88 35.06,94.79 34.99,94.87 34.99,98.15 38.04,101.19 39.03,101.19 v41.01,99.21 | v44.74,146.76 v44.74,148.13 | v46.19,140.74 46.95,139.98 49.62,139.98 50.69,141.05 51.14,141.05 51.6,140.59 51.6,137.16 51.14,136.7 51.14,135.79 51.6,135.33 51.6,132.97 50.61,131.98 v48.55,131.98 | v46.19,125.42 45.12,125.42 v41.46,121.77
  Bottom 0.152: v37.58,66.67 39.79,64.47 39.79,11.96 40.63,11.12 41.46,11.12 42,11.66 42,12.72 41.08,13.64 41.08,14.55 P20.16 | v37.96,82.53 35.9,82.53 34.99,83.44 34.99,86.03 35.29,86.33 35.29,87.1 34.68,87.71 34.68,93.5 v35.06,93.88 | P9.15 41.08,95.25 42,96.16 42,98.22 v41.01,99.21 40.78,99.44 40.78,120.62 41.46,121.31 v41.46,121.77 | v44.74,148.13 44.74,150.72 43.98,151.49 43.29,151.49 41.77,153.01 41.08,153.01 P11.15 | v44.74,146.76 44.74,144.17 45.2,143.71 45.2,141.73 v46.19,140.74 | v48.55,131.98 48.55,131.06 48.93,130.68 48.93,128.17 v46.19,125.42
1-GPIO1_17  (via drill 0.38)
  Top 0.152: v53.73,86.94 52.82,87.86 52.82,93.88 51.45,95.25 P9.23 | P11.23 51.22,153.92 50.84,154.31 50.84,155.45 50.91,155.52 50.91,155.98 50.46,156.44 50,156.44 49.54,155.98 49.54,153.54 49.62,153.47 49.62,150.04 48.48,148.89 47.41,148.89 45.96,147.45 v45.43,147.45 | v44.36,134.19 45.58,132.97 v45.58,129.92 | v49.24,105.16 v49.24,110.72
  Bottom 0.152: P20.24 51.22,13.72 50.23,12.72 50.23,11.66 50.76,11.12 51.68,11.12 52.51,11.96 52.51,33.83 55.03,36.35 55.03,85.65 v53.73,86.94 | v45.43,147.45 43.6,147.45 42.61,146.46 42.61,141.43 44.36,139.68 v44.36,134.19 | v45.58,129.92 45.58,129.31 45.2,128.93 45.2,123.29 45.96,122.53 45.96,114 v49.24,110.72 | v49.24,105.16 49.24,104.7 50.23,103.71 50.23,96.24 P9.23
1-GPIO1_28  (via drill 0.38)
  Top 0.152: P17.11 35.98,16 37.58,14.4 37.58,14.17 38.42,13.33 v75.07,13.33 | v86.35,62.03 88.18,62.03 93.74,67.59 93.74,88.7 93.97,88.92 93.97,105.77 93.81,105.92 93.81,111.94 91.6,114.15 v89.17,114.15 | v87.72,122 84.59,122 83.6,122.99 69.81,122.99 65.7,118.87 58.31,118.87 v57.7,119.48 | v58.61,120.4 58.15,120.4 52.44,126.11 50.61,126.11 50.46,125.96 46.57,125.96 46.42,126.11 43.6,126.11 43.41,125.92 | v39.26,121.77 43.41,125.92 | v35.98,102.26 v38.95,105.23 | v38.57,140.28 v36.89,141.96 | 43.41,125.92 v41.08,128.25
  Bottom 0.152: v75.07,13.33 75.07,13.79 75.68,14.4 75.68,51.36 v86.35,62.03 | v89.17,114.15 89.17,117.04 87.72,118.49 v87.72,122 | v58.61,120.4 v57.7,119.48 | v39.26,121.77 39.26,113.84 39.64,113.46 39.64,105.92 v38.95,105.23 | P9.12 v35.98,102.26 | P14.12 35.98,154.38 34.99,153.39 34.99,149.35 37.27,147.07 37.27,142.34 v36.89,141.96 | v38.57,140.28 41.08,137.77 v41.08,128.25
1-GPIO1_29  (via drill 0.38)
  Top 0.152: v55.18,139.06 53.12,141.12 53.12,141.58 54.11,142.57 54.19,142.57 54.72,143.1 54.72,145.09 P8.26 | v51.6,203.22 52.51,204.14 52.51,222.35 53.73,223.57 53.73,226.69 P15.26 | v50.23,155.75 50.23,149.58 v51.68,148.13
  Bottom 0.152: v55.18,139.06 55.64,138.61 55.64,132.28 54.88,131.52 54.88,90.53 53.81,89.46 53.81,88.32 P18.25 | v51.6,203.22 51.6,182.96 51.75,182.8 51.75,168.94 50.23,167.41 v50.23,155.75 | P8.26 v51.68,148.13
1-GPIO1_30  (via drill 0.38)
  Top 0.152: v34.61,72.77 34.61,78.72 32.32,81 32.32,86.64 31.86,87.1 31.86,91.21 30.49,92.58 v29.27,92.58 | v27.9,93.95 27.9,94.34 27.14,95.1 27.14,107.29 28.21,108.36 28.21,109.5 38.11,119.41 45.96,119.41 v46.72,120.17 | v47.1,141.66 47.1,141.96 48.63,143.49 P8.21 | v50.91,203.91 49.92,204.9 49.92,219.84 48.7,221.06 48.7,222.2 P12.21 | v50.91,201.09 59.98,192.02 63.87,192.02 v64.86,191.03 | v88.79,139.75 88.79,123.9 87.64,122.76 84.29,122.76 83.76,123.29 69.66,123.29 65.54,119.18 58.91,119.18 55.79,122.3 49.31,122.3 v48.86,122.76
  Bottom 0.152: P21.22 47.48,83.82 45.88,82.22 45.73,82.22 44.89,81.38 44.89,72.85 43.29,71.25 36.13,71.25 v34.61,72.77 | v27.9,93.95 v29.27,92.58 | v46.72,120.17 46.72,120.7 48.82,122.8 | 48.82,122.8 49.24,123.22 49.24,136.78 47.87,138.15 47.87,140.89 v47.1,141.66 | v50.91,201.09 v50.91,203.91 | v64.86,191.03 64.86,188.59 77.89,175.56 78.35,175.56 79.26,174.65 79.26,172.97 79.72,172.52 80.17,172.52 82.46,174.8 82.46,175.11 82.92,175.56 83.37,175.56 83.83,175.11 83.83,171.83 81.85,169.85 81.85,151.71 86.27,147.3 86.27,142.26 v88.79,139.75 | v48.86,122.76 48.82,122.8
1-GPIO1_31  (via drill 0.38)
  Top 0.152: v46.95,110.26 46.95,103.33 42.61,98.98 42.61,97.38 43.14,96.85 43.37,96.85 44.59,95.63 44.59,94.87 44.51,94.79 44.51,94.11 44.59,94.03 44.59,90.98 46.11,89.46 46.11,88.32 P18.19 | v45.05,135.56 45.05,141.05 47.1,143.1 47.1,145.09 P8.20 46.19,146.07 47.1,146.99 v47.1,147.6 | v52.44,172.14 47.1,166.8 47.1,149.5 v46.95,149.35
  Bottom 0.152: v46.95,110.26 43.98,113.23 43.98,131.22 45.43,132.66 45.43,135.18 v45.05,135.56 | v52.44,172.14 52.29,172.29 52.29,205.21 50.23,207.26 50.23,229.06 49.08,230.2 48.25,230.2 47.71,229.67 47.71,229.44 46.19,227.91 46.19,226.69 P15.20 | v46.95,149.35 46.95,147.75 v47.1,147.6
1-GPIO2_1  (via drill 0.38)
  Top 0.152: v50.23,104.7 v45.2,99.67 | v50.91,128.25 50.91,128.7 42.07,137.54 42.07,140.59 44.59,143.1 44.59,145.01 43.6,146 P8.18 43.6,147.9 44.59,148.89 44.59,153.39 43.98,154 v43.98,154.31 | P15.18 43.6,227.84 44.59,228.83 44.59,229.59 43.98,230.2 43.22,230.2 42.3,229.29 42.3,181.28 39.94,178.92 v39.94,178.08 | v41.62,170.08 41.62,169.47 v42.46,168.63
  Bottom 0.152: P18.17 43.6,89.46 44.59,90.45 44.59,94.03 44.51,94.11 44.51,94.79 45.2,95.48 v45.2,99.67 | v50.23,104.7 50.23,107.29 50,107.52 50,107.97 52.13,110.11 52.13,123.22 50.15,125.2 50.15,125.65 50.91,126.42 v50.91,128.25 | v39.94,178.08 39.94,177.62 41.62,175.95 v41.62,170.08 | v42.46,168.63 43.37,168.63 44.89,167.11 44.89,157.12 43.98,156.21 v43.98,154.31
1-GPIO2_6  (via drill 0.38)
  Top 0.152: v83.37,132.89 84.14,133.66 84.14,137.77 81.85,140.06 81.85,142.19 83.3,143.64 83.3,144.4 83.11,144.59 | 83.11,144.59 82.69,145.01 80.63,145.01 79.18,143.56 P8.45 | v85.58,147.07 v87.64,149.12 | 83.11,144.59 v83.37,144.86
  Bottom 0.152: P21.46 83.37,83.82 89.32,89.76 89.78,89.76 90.92,88.62 90.92,87.25 91.38,86.79 91.83,86.79 93.05,88.01 93.05,98.45 83.07,108.43 83.07,132.59 v83.37,132.89 | v87.64,149.12 87.64,168.71 89.32,170.38 89.32,177.93 88.56,178.69 88.56,198.43 81.85,205.13 81.85,218.39 79.18,221.06 79.18,222.2 P12.45 | v83.37,144.86 v85.58,147.07
1-GPIO2_7  (via drill 0.38)
  Top 0.152: v85.89,92.66 85.89,97.99 86.58,98.68 86.58,105.92 v85.28,107.21 | v85.28,124.66 85.28,126.8 84.98,127.1 84.98,129.77 86.12,130.91 v86.12,132.13 | v82.31,135.94 82.31,139.14 81.55,139.9 81.55,142.34 82.99,143.79 82.99,144.25 82.54,144.7 81.7,144.7 79.56,142.57 78.73,142.57 78.19,143.1 78.19,145.09 P8.46 79.18,146.07 79.41,146.07 80.4,147.07 80.4,153.62 79.72,154.31 78.42,154.31 75.68,157.05 75.68,159.79 73.09,162.38 v73.09,170.31 | v80.33,198.35 80.33,222.43 79.18,223.57 79.18,226.69 P15.46 | v70.57,179.68 v73.7,182.8
  Bottom 0.152: v85.89,92.66 82.69,89.46 82.08,89.46 80.94,88.32 79.18,88.32 P18.45 | v85.28,124.66 v85.28,107.21 | v82.31,135.94 v86.12,132.13 | v80.33,198.35 80.33,189.43 v73.7,182.8 | v70.57,179.68 70.57,172.82 v73.09,170.31
1-GPIO2_8  (via drill 0.38)
  Top 0.152: v78.73,101.35 v81.7,98.37 | v71.79,184.71 71.79,184.4 v68.21,180.82 | v79.95,161.54 79.95,160.63 80.71,159.87 80.71,146.23 v79.26,144.78
  Bottom 0.152: v81.7,98.37 88.1,91.97 88.1,91.52 85.43,88.85 82.38,88.85 80.56,87.02 78.88,87.02 76.67,84.81 76.67,83.82 P21.44 | v78.73,101.35 78.73,117.35 79.11,117.73 79.11,118.19 76.29,121.01 76.29,141.2 77.05,141.96 77.05,143.1 76.67,143.49 P8.43 77.05,143.18 78.65,144.78 v79.26,144.78 | v71.79,184.71 71.79,188.52 75.75,192.48 75.75,194 72.78,196.98 72.78,222.35 73.62,223.19 74.54,223.19 75.45,222.28 76.59,222.28 P12.43 | v68.21,180.82 69.43,180.82 69.66,181.05 70.12,181.05 73.55,177.62 73.55,171.91 78.19,167.26 78.19,163.3 v79.95,161.54
1-GPIO2_9  (via drill 0.38)
  Top 0.152: v75.68,208.41 75.68,222.66 76.59,223.57 76.59,226.69 P15.44 | v69.89,180.37 v73.01,183.49
  Bottom 0.152: P18.43 76.59,88.32 76.59,89.46 75.07,90.98 75.07,92.89 73.09,94.87 73.09,104.47 75.68,107.06 75.68,145.09 76.59,146 P8.44 76.59,146.07 76.59,149.12 75.68,150.04 75.68,166.8 69.89,172.59 v69.89,180.37 | v75.68,208.41 75.68,205.66 76.29,205.05 76.29,186.77 v73.01,183.49
1-GPIO2_10  (via drill 0.38)
  Top 0.152: v87.41,91.75 87.41,97.08 87.03,97.46 87.03,97.92 87.34,98.22 v87.34,108.2 | v87.11,125.12 87.11,129.62 v86.42,130.3 86.5,130.3 87.26,131.06 87.26,139.14 89.39,141.28 89.39,154.61 89.01,154.99 v89.01,155.37 | v83.3,133.88 81.24,133.88 74.61,140.51 v74.38,140.51 | v91.83,193.62 v87.87,197.59 | v91.15,157.5 v91.15,172.29
  Bottom 0.152: P21.42 75.22,83.82 78.73,87.33 80.4,87.33 82.23,89.15 84.82,89.15 v87.41,91.75 | v87.34,108.2 87.34,111.86 86.73,112.47 86.73,124.74 v87.11,125.12 | v86.42,130.3 86.42,130.76 v83.3,133.88 | v74.38,140.51 74.38,143.18 74.08,143.49 P8.41 | P12.41 74.08,221.06 75.68,219.46 75.68,209.78 v87.87,197.59 | v91.83,193.62 91.83,172.97 v91.15,172.29 | v89.01,155.37 v91.15,157.5
1-GPIO2_11  (via drill 0.38)
  Top 0.152: P15.42 74.08,223.65 75.07,222.66 75.07,210.08 v74.99,210.01 | v83.15,174.88 v83.15,177.39 | v79.64,171.37 75.68,167.41 75.68,164.06 77.05,162.69 80.4,162.69 v88.71,154.38 | v84.14,127.1 82.77,127.1 82,126.34 77.66,126.34 v74.38,129.62
  Bottom 0.152: 71.53,141.31 73.09,142.88 73.09,145.01 74.08,146 P8.42 | 71.53,141.31 70.73,140.51 70.73,122.07 71.11,121.69 71.11,105.31 69.96,104.16 69.96,100.13 68.06,98.22 68.06,87.86 68.59,87.33 69.43,87.33 69.96,87.86 69.96,88.54 70.95,89.53 72.1,89.53 73.32,88.32 74.08,88.32 P18.41 | v74.99,210.01 78.96,206.05 78.96,200.63 83.07,196.52 83.07,177.47 v83.15,177.39 | v79.64,171.37 v83.15,174.88 | v88.71,154.38 88.71,140.74 89.47,139.98 89.47,135.18 87.11,132.82 87.11,130.07 v84.14,127.1 | v74.38,129.62 74.38,138.45 71.53,141.31
1-GPIO2_12  (via drill 0.38)
  Top 0.152: v71.79,86.18 71.56,85.95 71.56,83.82 P21.40 | v80.78,117.88 v78.04,115.14 | v79.18,149.2 76.52,149.2 75.53,150.19 75.53,152.93 74.46,154 73.7,154 72.48,152.78 72.48,152.09 | 72.48,152.09 72.48,144.47 71.56,143.56 P8.39 | v66.38,195.61 70.27,199.49 70.27,219.84 71.49,221.06 71.49,222.2 P12.39 | v79.95,173.2 79.95,172.82 77.89,170.76 73.55,170.76 73.32,170.99 72.86,170.99 70.57,168.71 70.57,152.63 71.11,152.09 72.48,152.09
  Bottom 0.152: v71.79,86.18 76.36,86.18 77.89,87.71 77.89,98.83 77.74,98.98 77.74,114.83 v78.04,115.14 | v80.78,117.88 80.78,121.08 80.4,121.46 80.4,127.94 80.71,128.25 80.71,147.68 v79.18,149.2 | v66.38,195.61 66.38,187.53 72.63,181.28 74,181.28 79.95,175.34 v79.95,173.2
1-GPIO2_13  (via drill 0.38)
  Top 0.152: v76.67,109.73 72.86,109.73 v68.97,113.61 | v68.06,146.91 68.52,146.91 68.82,147.22 69.89,147.22 | v66.31,183.49 v70.19,187.38 | 69.89,147.22 v69.89,149.12 | 69.89,147.22 v70.12,147.22
  Bottom 0.152: v76.67,109.73 76.67,104.93 75.68,103.94 75.68,94.79 77.58,92.89 77.58,87.86 76.75,87.02 73.47,87.02 72.25,88.24 71.56,88.24 P18.39 | v68.97,113.61 68.97,122.3 64.55,126.72 64.55,139.45 67.45,142.34 67.45,146.3 v68.06,146.91 | v70.12,147.22 70.34,147.22 71.49,146.07 P8.40 | v70.19,187.38 75.45,192.63 75.45,193.85 70.27,199.03 70.27,222.35 71.49,223.57 71.49,226.69 P15.40 | v66.31,183.49 66.31,171.07 70.27,167.11 70.27,149.5 v69.89,149.12
1-GPIO2_22  (via drill 0.38)
  Top 0.152: v55.33,199.49 55.33,220.14 56.25,221.06 56.25,222.2 P12.27 | v54.95,169.32 54.95,166.27 55.03,166.19 55.03,162.31 54.88,162.15 54.88,156.13 55.64,155.37 56.02,155.37 56.48,154.91 56.48,154.46 56.02,154 55.87,154 55.33,153.47 55.33,144.47 P8.27
  Bottom 0.152: P8.27 57.31,142.49 57.31,127.71 55.18,125.58 55.18,88.01 56.25,86.94 56.25,83.82 P21.28 | v55.33,199.49 55.33,169.7 v54.95,169.32
1-GPIO2_23  (via drill 0.38)
  Top 0.152: v67.6,103.17 v64.17,99.75 | 68.29,131.29 68.29,131.75 65.93,134.11 65.93,134.87 v59.45,141.35 | 68.29,131.29 v68.29,130.38 | v84.59,146.99 84.59,143.94 86.58,141.96 86.58,133.96 84.59,131.98 84.59,131.75 84.14,131.29 68.29,131.29
  Bottom 0.152: P21.30 58.84,86.87 59.83,87.86 59.83,92.89 59.07,93.65 59.07,94.11 59.83,94.87 59.83,95.55 61.12,96.85 61.81,96.85 62.95,97.99 62.95,98.53 v64.17,99.75 | v67.6,103.17 67.6,108.74 70.12,111.25 70.12,128.55 v68.29,130.38 | v59.45,141.35 59.45,142.88 58.84,143.49 P8.29 | P12.29 58.84,225.32 60.44,226.92 60.44,227.15 60.97,227.69 61.73,227.69 62.65,226.77 62.65,202.62 64.17,201.09 64.17,188.82 77.74,175.26 78.19,175.26 78.96,174.5 78.96,169.93 81.55,167.33 81.55,150.04 v84.59,146.99
1-GPIO2_24  (via drill 0.38)
  Top 0.152: v53.89,99.59 54.72,98.75 54.72,90.98 56.25,89.46 56.25,88.32 P18.27 | v53.89,107.59 53.89,110.49 48.32,116.05 39.03,116.05 36.21,113.23 35.75,113.23 35.29,113.69 v35.29,115.67 | v33.54,149.2 34.68,150.34 34.68,161.24 v36.66,163.22 | v37.27,168.71 42.23,173.66 51.98,173.66 52.93,172.71 | 52.93,172.71 57.24,168.4 v57.24,162.23 | v52.97,175.72 52.97,172.75 52.93,172.71
  Bottom 0.152: v53.89,107.59 v53.89,99.59 | v35.29,115.67 35.29,129.01 34.38,129.92 34.38,139.75 32.63,141.5 32.63,142.95 32.47,143.1 32.47,148.13 v33.54,149.2 | v36.66,163.22 36.66,163.75 37.27,164.36 v37.27,168.71 | v57.24,162.23 57.24,148.28 57.31,148.21 57.31,147.07 P8.28 | v52.97,175.72 53.66,176.4 53.66,206.2 52.82,207.03 52.82,222.66 56.25,226.09 56.25,226.69 P15.28
1-GPIO2_25  (via drill 0.38)
  Top 0.152: v58.23,96.55 58.23,97 57.85,97.38 57.85,106.22 v58.15,106.53 | P15.30 58.84,223.65 60.13,222.35 60.13,196.67 65.54,191.26 65.54,190.81 65.09,190.35 60.97,190.35 v59.98,191.34
  Bottom 0.152: P18.29 58.84,89.46 57.85,90.45 57.85,96.16 v58.23,96.55 | v58.15,106.53 58.15,106.98 62.72,111.56 62.72,123.75 61.96,124.51 61.96,125.58 62.88,126.49 62.88,139.29 60.44,141.73 60.44,144.4 58.84,146 P8.30 58.84,146.07 62.65,149.88 62.65,173.13 59.22,176.56 59.22,190.58 v59.98,191.34
1-GPIO3_19  (via drill 0.38)
  Top 0.152: v55.56,86.18 57.24,87.86 57.24,93.34 56.32,94.26 56.32,95.25 P9.27 | v54.72,154.61 54.42,154.61 53.96,155.07 v51.83,155.07 | v49.24,148.36 49.69,148.36 v50.69,147.37 | v51.83,136.47 51.83,135.56 51.9,135.48 51.9,131.98 v51.83,131.9 | v51.45,122.99 v52.36,123.9 | v56.55,110.41 v51.45,115.52
  Bottom 0.152: v55.56,86.18 55.33,85.95 55.33,31.24 55.03,30.94 55.03,11.96 55.87,11.12 56.7,11.12 57.24,11.66 57.24,12.72 56.32,13.64 56.32,14.55 P20.28 | v54.72,154.61 P11.27 | v51.83,155.07 49.31,155.07 47.71,153.47 47.71,152.63 48.86,151.49 49.08,151.49 49.62,150.95 49.62,148.74 v49.24,148.36 | v50.69,147.37 51.29,147.37 52.82,145.85 52.82,143.1 53.89,142.04 54.04,142.04 54.5,141.58 54.5,139.14 v51.83,136.47 | v51.83,131.9 51.83,130.53 52.36,130 v52.36,123.9 | v51.45,115.52 v51.45,122.99 | v56.55,110.41 56.55,107.21 55.79,106.45 55.79,99.67 57.24,98.22 57.24,96.16 56.32,95.25 P9.27
1-GPIO3_21  (via drill 0.38)
  Top 0.152: v49.69,20.8 49.69,19.2 53.73,15.16 53.73,14.63 P20.26 | v43.98,68.35 42,70.33 v42,75.21 | v46.57,93.42 46.57,93.88 47.71,95.02 47.71,95.63 48.93,96.85 49.08,96.85 49.62,97.38 49.62,98.83 52.29,101.5 v53.05,101.5 53.05,106.3 50.08,109.27 v50.08,109.42 | v56.63,147.98 56.63,147.52 57.85,146.3 57.85,136.09 59.07,134.87 59.07,134.42 58.31,133.66 v54.65,133.66 | v53.73,132.74 53.73,131.52 51.83,129.62 v51.37,129.62
  Bottom 0.152: v49.69,20.8 49.69,35.28 43.98,41 v43.98,68.35 | v42,75.21 42,75.67 41.85,75.82 41.85,76.28 42.61,77.04 42.61,78.49 44.59,80.47 44.59,85.34 45.88,86.64 45.88,87.17 45.2,87.86 45.2,92.05 v46.57,93.42 | v53.05,101.5 53.05,98.45 52.82,98.22 52.82,96.16 53.73,95.25 P9.25 | v56.63,147.98 55.33,149.28 55.33,150.57 53.81,152.09 53.81,153.01 P11.25 | v53.73,132.74 v54.65,133.66 | v51.37,129.62 49.54,127.79 49.54,117.42 50.08,116.89 v50.08,109.42
1-I2C1_SCL  (via drill 0.38)
  Top 0.152: v35.98,79.02 34.68,80.31 34.68,85.57 37.05,87.94 37.5,87.94 38.8,86.64 v38.8,86.26 | P11.17 43.6,151.87 42.61,150.88 42.61,145.69 v43.52,144.78 | v44.97,122.15 44.28,122.15 42.53,120.4 v41.46,120.4
  Bottom 0.152: P20.18 43.6,17.68 42,19.28 42,36.8 40.09,38.71 40.09,64.62 38.26,66.45 38.26,68.2 33.92,72.54 33.92,73 34.38,73.46 35.45,73.46 35.6,73.3 36.36,73.3 36.97,73.91 36.97,78.03 v35.98,79.02 | v38.8,86.26 40.4,86.26 42.3,88.16 42.3,93.73 43.6,95.02 P9.17 42.61,96.24 42.61,98.15 42.99,98.53 42.99,102.11 41.08,104.01 41.08,105.69 41.62,106.22 41.62,117.96 41.46,118.11 v41.46,120.4 | v43.52,144.78 43.67,144.78 44.89,143.56 44.89,140.97 46.04,139.83 46.04,131.75 44.59,130.3 44.59,122.53 v44.97,122.15
1-I2C1_SDA  (via drill 0.38)
  Top 0.152: v42.68,70.56 42.68,73.84 42.61,73.91 42.61,74.68 43.83,75.89 44.06,75.89 45.2,77.04 v45.2,86.87 | v45.2,94.34 45.2,96.16 43.6,97.77 P9.18 43.6,98.98 48.02,103.4 v48.02,106.45 | v47.41,146.38 47.41,142.88 45.5,140.97 45.5,136.02 v47.87,133.66 | v50.23,126.64 v48.25,128.63
  Bottom 0.152: P17.17 43.6,20.19 42.3,21.49 42.3,34.37 43.6,35.66 43.6,39.62 42.61,40.62 42.61,70.48 v42.68,70.56 | v45.2,86.87 45.2,87.4 44.89,87.71 44.89,92.51 45.2,92.81 v45.2,94.34 | P14.18 43.6,154.84 42.61,153.85 42.61,152.63 43.45,151.79 44.13,151.79 45.2,150.72 45.2,148.59 v47.41,146.38 | v47.87,133.66 47.87,132.74 47.48,132.36 47.48,129.39 v48.25,128.63 | v50.23,126.64 50.23,126.19 49.85,125.81 49.85,117.58 50.76,116.66 50.76,109.19 v48.02,106.45
1-I2C2_SCL  (via drill 0.38)
  Top 0.152: v48.25,38.63 47.71,38.1 47.71,19.28 46.19,17.75 46.19,14.63 P20.20 | v49.62,75.97 49.62,84.96 47.71,86.87 47.71,92.89 v48.78,93.95 | v48.78,99.06 48.55,99.06 47.1,97.61 47.1,96.16 46.19,95.25 P9.19 | v43.45,133.43 41.77,135.1 41.77,140.74 42,140.97 42,150.72 42.38,151.1 42.38,153.62 43.75,154.99 44.21,154.99 46.11,153.09 P11.19
  Bottom 0.152: v48.25,38.63 48.25,72.47 49.62,73.84 v49.62,75.97 | v48.78,93.95 49.62,94.79 49.62,98.22 v48.78,99.06 48.78,102.49 43.07,108.2 43.07,132.59 43.45,132.97 v43.45,133.43
1-I2C2_SDA  (via drill 0.38)